# EAGLE design pc_max30205_brk (EAGLE 6.4)
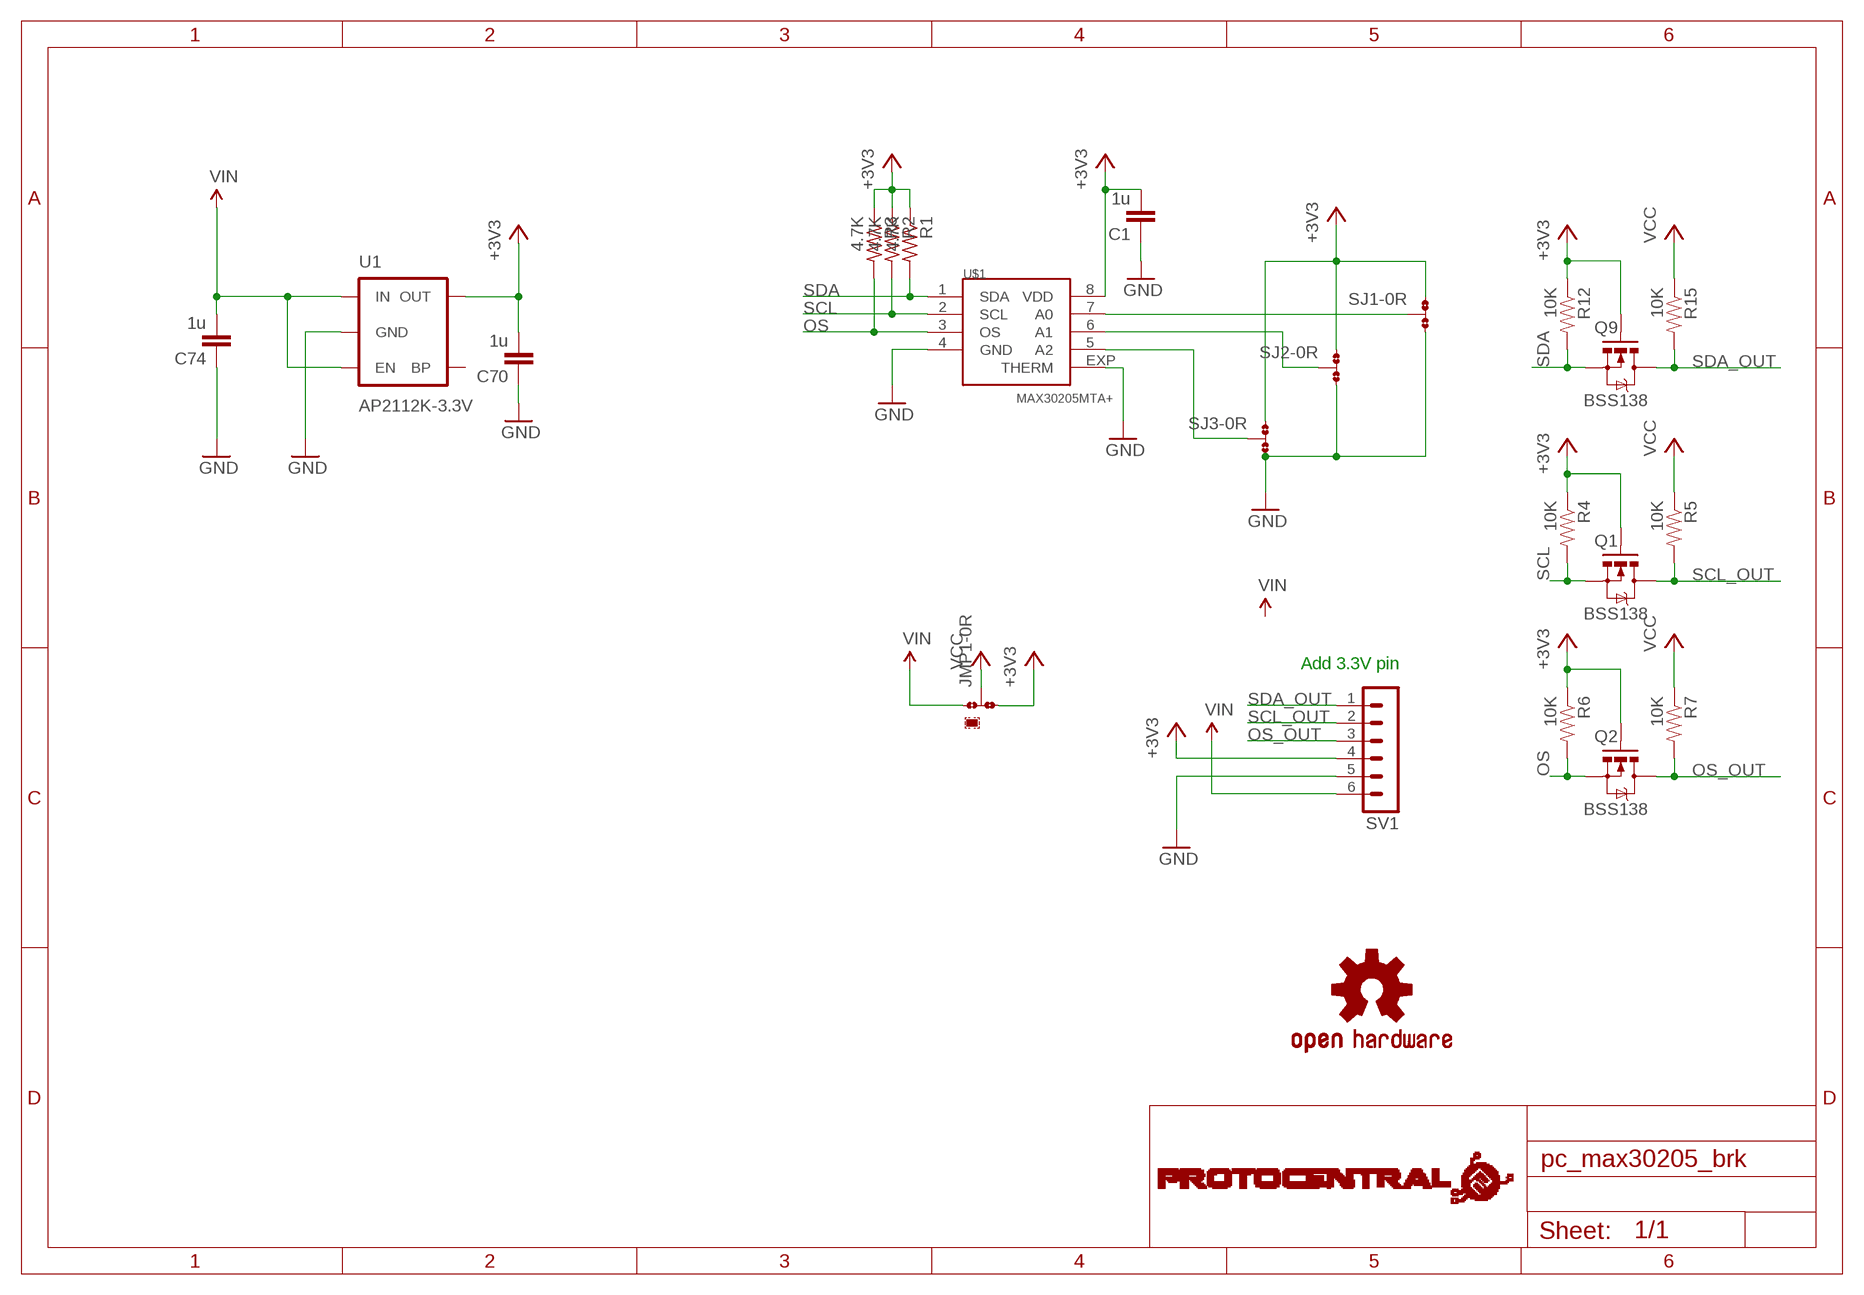
[diagram p0: schematic, sheet 1]

## Parts
C1  1u  C-EUC0805  [C0805]
C70  1u  C-EUC0805  [C0805]
C74  1u  C-EUC0805  [C0805]
JMP1  0R-JUMPA  [A0R-JMP-0402]
Q1  BSS138  MOSFET-NCHANNELSMD  [SOT23-3]
Q2  BSS138  MOSFET-NCHANNELSMD  [SOT23-3]
Q9  BSS138  MOSFET-NCHANNELSMD  [SOT23-3]
R1  4.7K  R-US_R0402  [R0402]
R2  4.7K  R-US_R0402  [R0402]
R3  4.7K  R-US_R0402  [R0402]
R4  10K  RESISTOR0805-RES  [0805]
R5  10K  RESISTOR0805-RES  [0805]
R6  10K  RESISTOR0805-RES  [0805]
R7  10K  RESISTOR0805-RES  [0805]
R12  10K  RESISTOR0805-RES  [0805]
R15  10K  RESISTOR0805-RES  [0805]
SJ1  0R-JUMPA  [A0R-JMP-0402]
SJ2  0R-JUMPA  [A0R-JMP-0402]
SJ3  0R-JUMPA  [A0R-JMP-0402]
SV1  MA06-1  [MA06-1]
U1  AP2112K-3.3V  V_REG_LDOSMD  [SOT23-5]
U$1  MAX30205MTA+  [TDFN-08]
U$5  PROTY-LOGO  [LOGO-PROTY]
U$7  OSHW-LOGOS  [OSHW-LOGO-S]

## Nets
+3V3: C1.2 C70.2 JMP1.3 Q1.1(G) Q2.1(G) Q9.1(G) R1.1 R2.1 R3.1 R4.1 R6.1 R12.1 SJ1.1 SJ2.1 SJ3.1 SV1.4 U1.5(OUT) U$1.8(VDD)
A0: SJ1.2 U$1.7(A0)
A1: SJ2.2 U$1.6(A1)
A2: SJ3.2 U$1.5(A2)
GND [gnd]: C1.1 C70.1 C74.1 SJ1.3 SJ2.3 SJ3.3 SV1.5 U1.2(GND) U$1.4(GND) U$1.EXP(THERM)
OS: Q2.2(S) R3.2 R6.2 U$1.3(OS)
OS_OUT: Q2.3(D) R7.2 SV1.3
SCL: Q1.2(S) R2.2 R4.2 U$1.2(SCL)
SCL_OUT: Q1.3(D) R5.2 SV1.2
SDA: Q9.2(S) R1.2 R12.2 U$1.1(SDA)
SDA_OUT: Q9.3(D) R15.2 SV1.1
VCC: JMP1.2 R5.1 R7.1 R15.1
VIN: C74.2 JMP1.1 SV1.6 U1.1(IN) U1.3(EN)
Unconnected: U1.4(BP)

## Notes on the sheet
- Add 3.3V pin

## Library data of the parts
C1 C70 C74 = rcl:C-EU: CAPACITOR, European symbol
JMP1 SJ1-SJ3 = circuitects:0R-JUMP: SMD 0R 0402 Jumper
Q1 Q2 Q9 = SparkFun:MOSFET-NCHANNEL
R1-R3 = rcl:R-US_: RESISTOR, American symbol
R4-R7 R12 R15 = SparkFun:RESISTOR: Resistor Basic schematic elements and footprints for 0603, 1206, and PTH resistors.
SV1 = con-lstb:MA06-1: PIN HEADER; OC_FARNELL: unknown; OC_NEWARK: unknown
U1 = SparkFun-PowerIC:V_REG_LDO: Voltage Regulator LDO Standard 150mA LDO voltage regulator in SOT-23 layout. Micrel part MIC5205. BP (by-pass) pin is used to lower output noise with 470pF cap.; PROD_ID: VREG-12457
U$1 = circuitects:MAX30205
U$5 = circuitects:PROTY-LOGO
U$7 = SparkFun:OSHW-LOGO: Open Source Hardware Logo This logo indicates the piece of hardware it is found on incorporates a OSHW license and/or adheres to the definition of open source hardware found here: http://freedomdefined.org/OSHW

## Net classes
2 gnd: width 0.102 mm, drill 0.1 mm

## Board
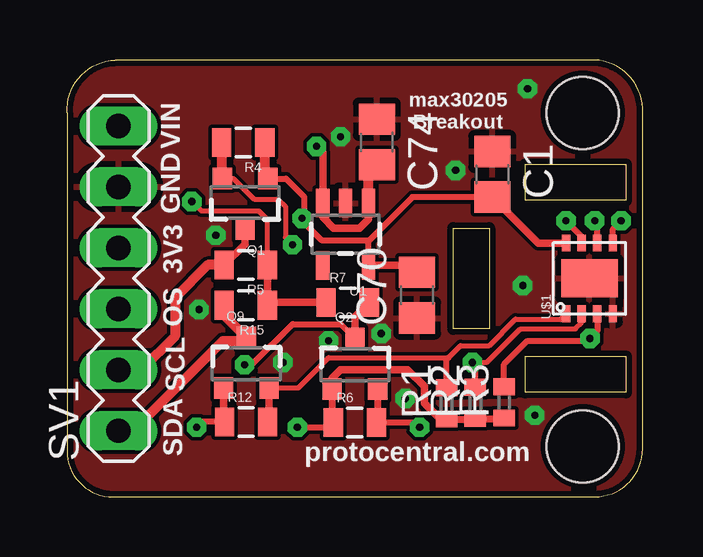
[diagram p1: board, top side]
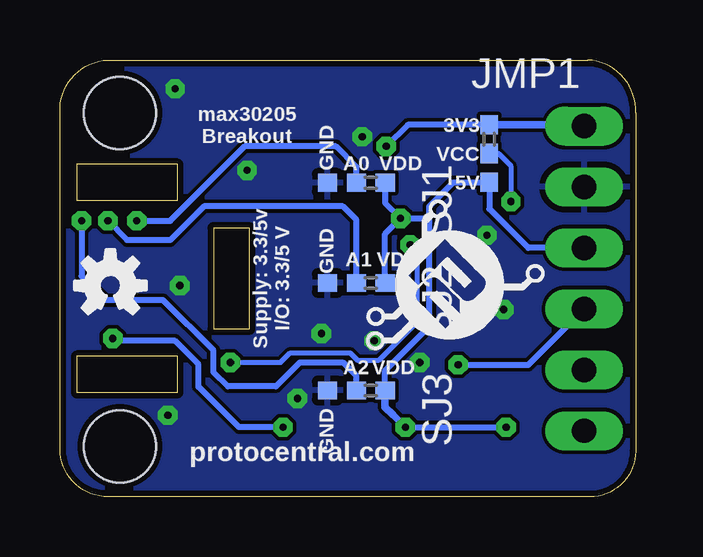
[diagram p2: board, bottom side, seen from below]

Size 24 x 18.2 mm. Coordinates in mm from the lower left corner, seen from the top.
Outline: 1.9,0 22,0 arc90 24,2 24,16 arc90 22,18.2 2,18.2 arc90 0,16 0,1.9 arc90 1.9,0
Outline: 19.1,13.85 23.3,13.85 23.3,12.35 19.1,12.35 19.1,13.85
Outline: 19.1,5.85 23.3,5.85 23.3,4.35 19.1,4.35 19.1,5.85
Outline: 16.1,7 16.1,11.2 17.6,11.2 17.6,7 16.1,7
Copper layers (1*2*15*16): Top 0.035mm / dielectric 1.5mm / Route2 0.035mm / dielectric 0.15mm / Route15 0.035mm / dielectric 0.2mm / Bottom 0.035mm
Design rules "Circuitects-Rules": minimum track width 6mil, minimum drill 0.3mm, track to track 6mil, track to pad 6mil, pad to pad 6mil, via to via 6mil, smd to smd 6mil, copper to edge 10mil, drill to drill 8mil, minimum pad ring 12mil, minimum via ring 10mil, stop-mask expansion 4mil, vias tented up to drill 25mil, thermal gap 10mil
Holes 3 mm at 21.5,2.1 21.5,16

### Footprints (pad centres in the part's own frame; a part is rotated, then mirrored left to right if it is on the bottom)
C0805 = smd 1.3 x 1.5: 1 -0.95,0; 2 0.95,0
A0R-JMP-0402 = smd 0.74 x 0.8: 1 0,1.2; 2 0,0; 3 0,-1.2
SOT23-3 = smd 0.8 x 0.9: 1 -0.95,-1; 2 0.95,-1; 3 0,1.1
R0402 = smd 0.7 x 0.9: 1 -0.65,0; 2 0.65,0
0805 = smd 0.8 x 1.2: 1 -0.9,0; 2 0.9,0
MA06-1 = drill 1.016 long: 1 -6.35,0; 2 -3.81,0; 3 -1.27,0; 4 1.27,0; 5 3.81,0; 6 6.35,0
SOT23-5 = smd 0.55 x 1.2: 1 -0.95,-1.3; 2 0,-1.3; 3 0.95,-1.3; 4 0.95,1.3; 5 -0.95,1.3
TDFN-08 = smd 0.7 x 0.35: 1 -1.475,0.975; 2 -1.475,0.325; 3 -1.475,-0.325; 4 -1.475,-0.975; 5 1.475,-0.975; 6 1.475,-0.325; 7 1.475,0.325; 8 1.475,0.975 | smd 1.58 x 2.35: EXP 0,0

### Placement (x,y rotation side)
C1  17.73,13.44 270 top
C70  14.59,8.4 90 top
C74  12.91,14.78 270 top
JMP1  6.1,14.3 0 bottom
Q1  7.42,12.26 180 top
Q2  12,5.5 0 top
Q9  7.47,5.54 0 top
R1  15.82,3.89 90 top
R2  17.02,3.91 90 top
R3  18.22,3.93 90 top
R4  7.34,14.76 180 top
R5  7.45,9.66 180 top
R6  12,3.1 0 top
R7  11.7,8.1 0 top
R12  7.46,3.12 0 top
R15  7.45,7.98 180 top
SJ1  11.64,13.09 270 bottom
SJ2  11.64,8.91 270 bottom
SJ3  11.64,4.43 270 bottom
SV1  2.14,9.1 90 top
U1  11.61,10.94 180 top
U$1  21.78,9.1 90 top
U$5  11.3,6 0 bottom
U$7  21.9,8.8 0 bottom

### Tracks (layer width: path | path; a pad name or v marks a point on that pad's centre or on a via)
+3V3  (via drill 0.3)
  Top 0.152: Q1.1 8.37,13.23
  Top 0.254: R12.1 5.62,3.12 v5.4,2.9 | v9.6,2.9 10.9,2.9 R6.1 | Q1.1 9.13,13.26 9.89,12.5 9.89,11.69 v9.8,11.6 9.8,11.5 10.6,10.7 12.6,10.7 | 12.6,10.7 14.39,12.49 C1.2 | U1.5 12.56,10.66 12.6,10.7
  Top 0.3: Q2.1 11.05,3.15 R6.1 | 17.54,12.3 C1.2 | R1.1 15.86,3.24 17.3,3.24 R2.1 18.5,3.26 R3.1
  Top 0.305: Q9.1 6.52,3.16 R12.1 | 14.7,9.46 C70.2 14.3,9.64 U1.5 | U$1.8 19.65,10.57 C1.2 | 15.86,3.24 15.56,3.24 14.9,3.9 14.9,4.6 14.2,5.3 11.4,5.3 11.05,4.95 Q2.1
  Top 0.406: R4.1 8.24,13.39 Q1.1
  Bottom 0.254: v9.6,2.9 v5.4,2.9 | SJ3.1 10.44,5.26 8.6,7.1 8.6,11.4 | SJ2.1 10.44,10.96 v9.8,11.6 | SV1.4 4.47,10.37 6.1,12 JMP1.3 7.6,13.1 8.6,12.1 8.6,11.4 | v9.8,11.6 8.8,11.6 8.6,11.4 | SJ1.1 10.44,12.24 v9.8,11.6
  Bottom 0.3: 10.12,3.42 v9.6,2.9
  Bottom 0.305: SJ3.1 10.44,3.74 10.12,3.42
A0  (via drill 0.3)
  Top 0.254: U$1.7 21.46,10.85 v20.8,11.5
  Bottom 0.254: v20.8,11.5 19.4,11.5 16.3,14.6 12.5,14.6 11.64,13.74 SJ1.2
A1  (via drill 0.3)
  Top 0.254: U$1.6 22.11,11.39 v22,11.5
  Bottom 0.254: SJ2.2 11.64,11.54 12.2,12.1 18,12.1 19.4,10.7 21.2,10.7 v22,11.5
A2  (via drill 0.3)
  Top 0.254: U$1.5 22.76,11.15 v23.1,11.5
  Bottom 0.254: v23.1,11.5 23.1,9.2 22.1,8.2 19.7,8.2 17.6,6.1 17.6,5.2 17,4.6 15,4.6 14,5.6 12.2,5.6 11.64,5.04 SJ3.2
GND  (via drill 0.3)
  other vias: 16.2,13.6 19.5,3.4 19.2,17 13.1,6.8 11.4,15 19,8.8 14.1,4.1 5.5,7.8 10.9,6.5 9,5.6 6.2,10.9
  pour Top: 0.2,17.9 24.6,17.9 24.4,0 0,0
  pour Bottom: 0.2,17.9 24.6,17.9 24.4,0 0,0
OS  (via drill 0.3)
  Top 0.254: R6.2 14.5,3.1 v14.7,2.9 | U$1.3 22.11,6.91 v21.8,6.6 21.7,6.5 19.2,6.5 18.22,5.52 R3.2
  Top 0.3: Q2.2 12.95,3.15 R6.2
  Bottom 0.254: v21.8,6.6 21.7,6.5 19.2,6.5 18.22,5.52 R3.2 16.54,2.9 v14.7,2.9
OS_OUT  (via drill 0.3)
  Top 0.254: Q2.3 11.4,7.2 9.4,7.2 7.7,5.5 v7.4,5.5
  Top 0.305: Q2.3 12,7.5 R7.2
  Bottom 0.254: v7.4,5.5 4.47,5.5 SV1.3
SCL  (via drill 0.3)
  Top 0.2: Q1.2 6.94,13.26 7.8,12.4 8.8,12.4 9.1,12.1 9.1,10.8 v9.4,10.5 | v16.9,5.6 17.5,5.6 18.9,7 21.2,7 21.46,7.25 U$1.2
  Top 0.254: R2.2 17.02,5.48 v16.9,5.6
  Top 0.406: R4.2 6.44,13.29 Q1.2
  Bottom 0.2: v16.9,5.6 14.8,5.6 14.4,6 11.9,6 11.6,5.7 10.7,5.7 9.1,7.3 9.1,10.2 v9.4,10.5
SCL_OUT
  Top 0.305: Q1.3 7.42,10.53 R5.2
  Top 0.406: R5.2 5.86,9.66 4.5,8.3 4.5,6.7 3.09,5.29 SV1.2
SDA
  Top 0.2: Q9.2 9.64,4.54 10.9,5.8 15.9,5.8 16.4,6.3 17.6,6.3 18.7,7.4 20.58,7.4 U$1.1
  Top 0.254: R1.2 15.82,5.72 15.9,5.8
  Top 0.305: Q9.2 8.42,3.18 R12.2
SDA_OUT
  Top 0.406: R15.2 6.55,7.56 Q9.3 7.33,6.5 6.5,6.5 2.75,2.75 SV1.1
VCC  (via drill 0.3)
  Top 0.2: R5.1 8.35,11.55 8,11.9 5.6,11.9 v5.2,12.3
  Top 0.305: R5.1 R15.1 8.47,8.1 R7.1
  Bottom 0.2: JMP1.2 5.7,14.3 5.2,13.8 v5.2,12.3
VIN  (via drill 0.3)
  Top 0.305: v10.4,14.6 10.66,14.34 U1.3 10.66,11.64 11.1,11.2 12.2,11.2 12.56,11.56 U1.1
  Top 0.406: U1.1 12.56,13.48 C74.2
  Bottom 0.254: JMP1.1 9.5,15.5 v10.4,14.6
  Bottom 0.305: JMP1.1 2.19,15.5 SV1.6

### Text on the board
tPlace: max30205 / Breakout | VIN | GND | 3V3 | OS | SCL | SDA | protocentral.com
bPlace: 3V3 | GND | max30205 / Breakout | VCC | VDD | A0 | 5V | GND | VDD | A1 | Supply: 3.3/5v / I/O: 3.3/5 V | VDD | A2 | GND | protocentral.com